# Altium schematic sheet Sheet1.SchDoc
size A; SheetNumber: 1; SheetTotal: 1
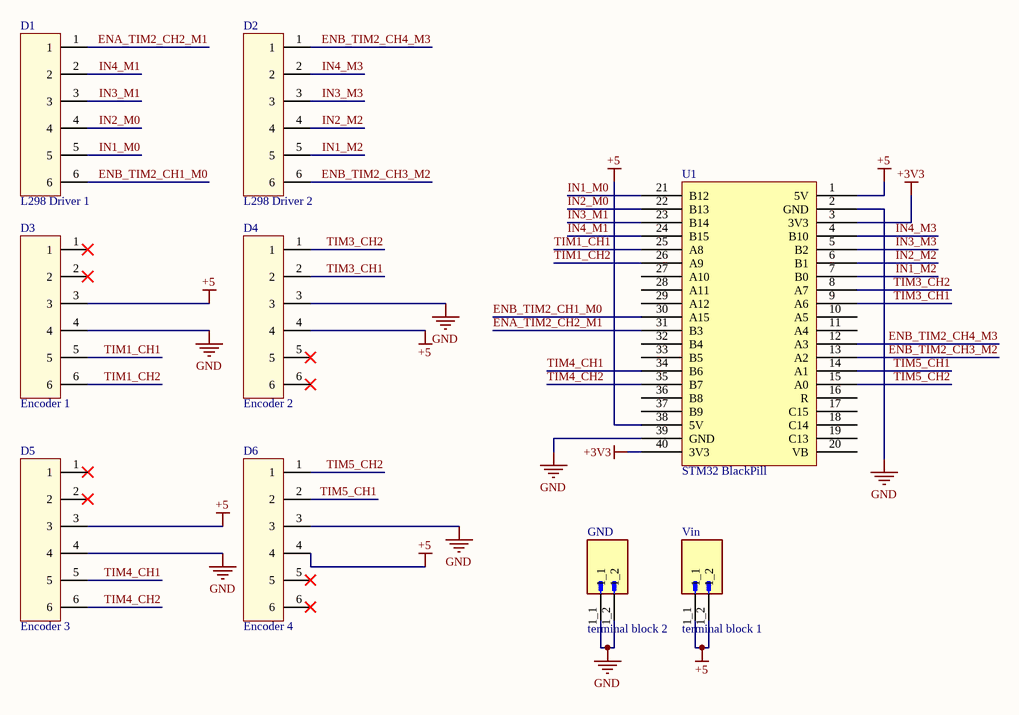
[diagram p0: Sheet1.SchDoc]

## Parts
D1  L298 Driver 1  [DATA_PIN_HEADER_6_2.54m]
D2  L298 Driver 2  [DATA_PIN_HEADER_6_2.54m]
D3  Encoder 1  [DATA_PIN_HEADER_6_2.54m]
D4  Encoder 2  [DATA_PIN_HEADER_6_2.54m]
D5  Encoder 3  [DATA_PIN_HEADER_6_2.54m]
D6  Encoder 4  [DATA_PIN_HEADER_6_2.54m]
GND  terminal block 2  [KEYSTONE_1287]
U1  STM32 BlackPill  [STM 32 Black Pill]
Vin  terminal block 1  [KEYSTONE_1287]

## Nets
+3V3: U1.3(3V3) U1.40(3V3)
+5: D3.3 D4.4 D5.3 D6.4 U1.1(5V) U1.38(5V) Vin.1_1 Vin.1_2
GND: D3.4 D4.3 D5.4 D6.3 GND.1_1 GND.1_2 U1.2(GND) U1.39(GND)
ENA_TIM2_CH2_M1: D1.1 U1.31(B3)
ENB_TIM2_CH1_M0: D1.6 U1.30(A15)
ENB_TIM2_CH3_M2: D2.6 U1.13(A2)
ENB_TIM2_CH4_M3: D2.1 U1.12(A3)
IN1_M0: D1.5 U1.21(B12)
IN1_M2: D2.5 U1.7(B0)
IN2_M0: D1.4 U1.22(B13)
IN2_M2: D2.4 U1.6(B1)
IN3_M1: D1.3 U1.23(B14)
IN3_M3: D2.3 U1.5(B2)
IN4_M1: D1.2 U1.24(B15)
IN4_M3: D2.2 U1.4(B10)
TIM1_CH1: D3.5 U1.25(A8)
TIM1_CH2: D3.6 U1.26(A9)
TIM3_CH1: D4.2 U1.9(A6)
TIM3_CH2: D4.1 U1.8(A7)
TIM4_CH1: D5.5 U1.34(B6)
TIM4_CH2: D5.6 U1.35(B7)
TIM5_CH1: D6.2 U1.14(A1)
TIM5_CH2: D6.1 U1.15(A0)

Not connected (* = marked no-connect by the designer): D3 1* 2*; D4 5* 6*; D5 1* 2*; D6 5* 6*; U1 10(A5) 11(A4) 16(R) 17(C15) 18(C14) 19(C13) 20(VB) 27(A10) 28(A11) 29(A12) 32(B4) 33(B5) 36(B8) 37(B9)

## Library data of the parts
D1-D6 = DATA_PIN_HEADER_6_2.54m
GND Vin = 1287: Male .250 Quick Fit Terminal; MF: Keystone Electronics Corp.; SnapEDA_Link: https://www.snapeda.com/parts/1287/Keystone/view-part/?ref=snap; Package: None; Value: *; MP: 1287; Check_prices: https://www.snapeda.com/parts/1287/Keystone/view-part/?ref=eda
U1 = STM32 BlackPill: STM32F401CC